# EasyEDA schematic SCH_Arduino-Train-v.2_2026-09-02.json
TITLE: Arduino Train; REV: 2.0.6; Date: 2026-09-01; Sheet: 1/1; Drawn By: @avatorl
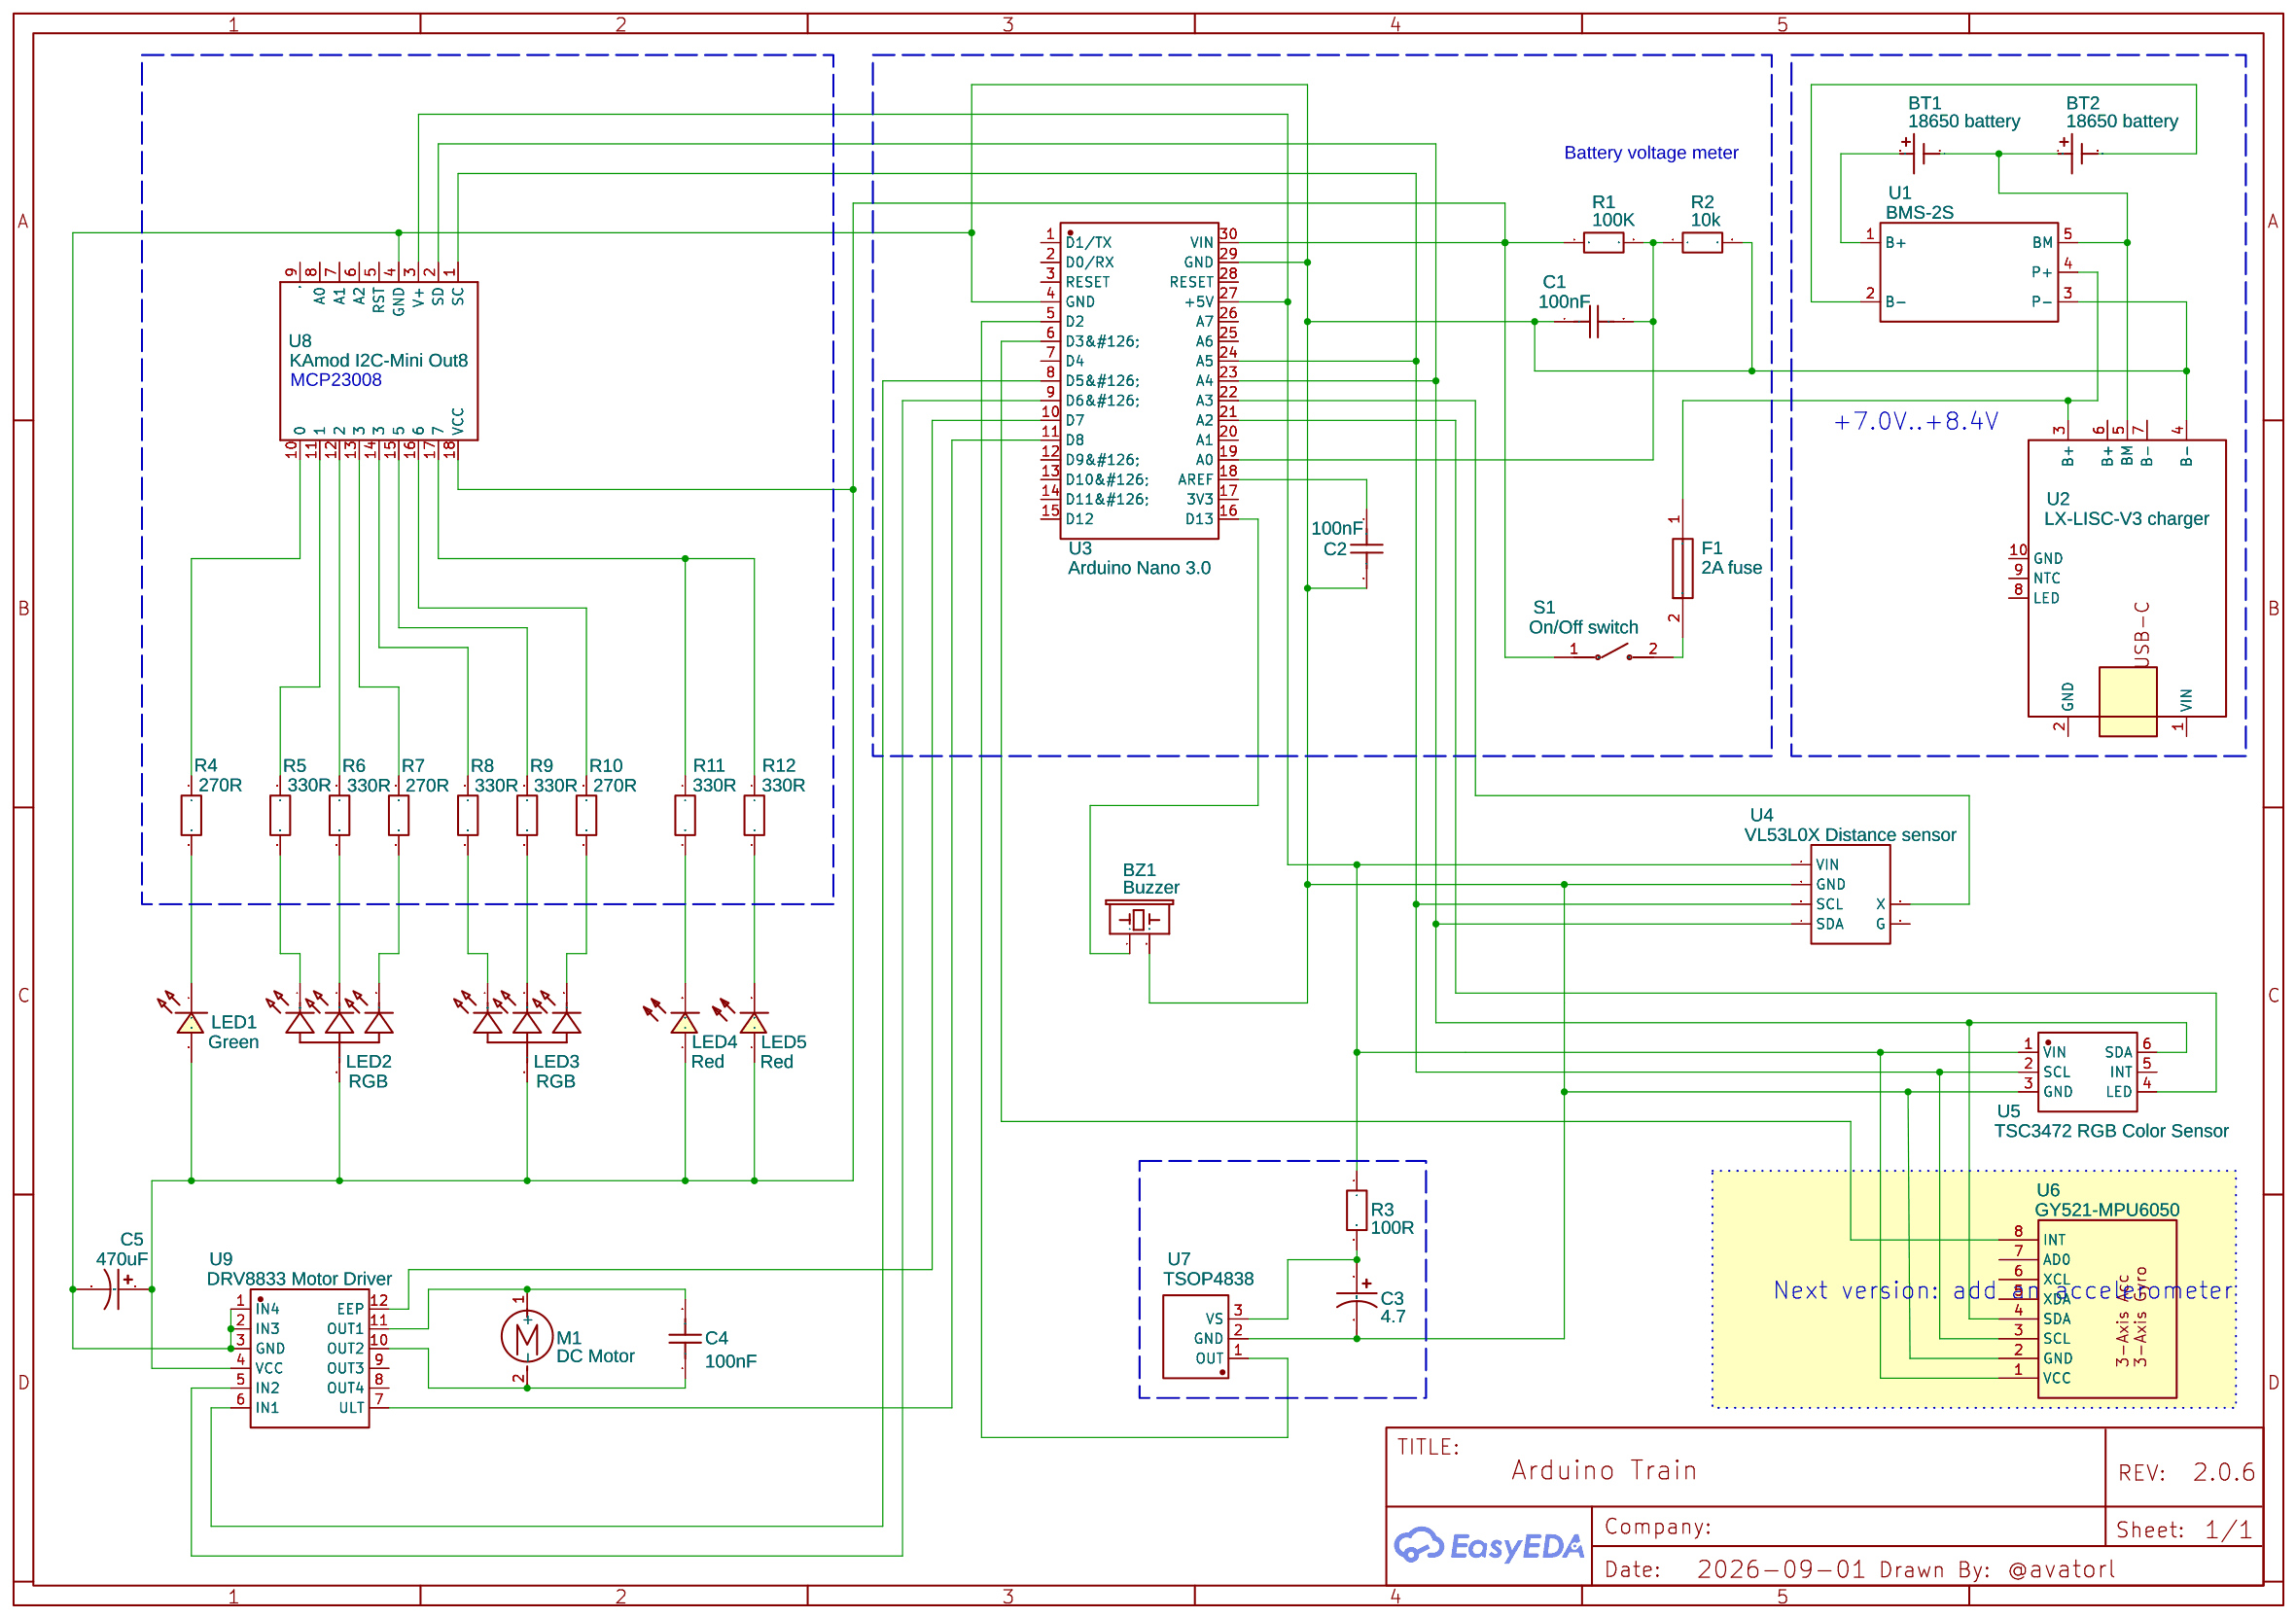
[diagram p0: schematic sheet]

## Parts
BT1  18650 battery  [HLD-18650]
BT2  18650 battery  [HLD-18650]
BZ1  Buzzer  [BUZZER-CMT1102]
C1  100nF  [CAPACITOR, 2.54MM PIN CAPACITOR]
C2  100nF  [CAPACITOR, 2.54MM PIN CAPACITOR]
C3  4.7  [ELECTROLITIC CAPACITOR 5MM]
C4  100nF  [CAPACITOR, 2.54MM PIN CAPACITOR]
C5  470uF  [ELECTROLITIC CAPACITOR 5MM]
F1  2A fuse  [FUSE_BLADE_PCB]
LED1  Green  [LED-TH_6P_LED4GREEN]
LED2  RGB  [LED-SMD_4P-L3.5-W2.8_3528RGB-6028RGB]
LED3  RGB  [LED-SMD_4P-L3.5-W2.8_3528RGB-6028RGB]
LED4  Red  [LED-TH_LED-3MM_RED]
LED5  Red  [LED-TH_LED-3MM_RED]
M1  DC Motor  [CONN-TH_2P-P5.08]
R1  100K  [R0603]
R2  10k  [R0603]
R3  100R  [R0603]
R4  270R  [R0603]
R5  330R  [R0603]
R6  330R  [R0603]
R7  270R  [R0603]
R8  330R  [R0603]
R9  330R  [R0603]
R10  270R  [R0603]
R11  330R  [R0603]
R12  330R  [R0603]
S1  On/Off switch  [SW-SMD_L3.9-W2.9-LS4.9-L]
U1  BMS-2S  [2S 3A-10A LITHIUM LI-ION 18650 BATTERY BMS PROTECTION PCB BOARD 7.4V/8.4V]
U2  LX-LISC-V3 charger  [LX-LISC-V1]
U3  Arduino Nano 3.0  [COMM-TH_ARDUINO_NANO]
U4  VL53L0X Distance sensor  [FFINAL_IDC-TH_8P-P2.54-V-R2-C4-S2.54]
U5  TSC3472 RGB Color Sensor  [SENSOR-SMD_TCS34725FN]
U6  GY521-MPU6050  [GY521-MPU6050]
U7  TSOP4838  [SENSOR-TH_TSOP4X]
U8  KAmod I2C-Mini Out8  [DIP18]
U9  DRV8833 Motor Driver  [DRV8833]

## Library data of the parts
BT1 BT2 = BAT-18650: Contributor: Rising Divergence
BZ1 = BUZZER: Contributor: SparkFun
C1 C2 C4 = C_0603_US: Contributor: antonioguadalupe265
C3 C5 = C_Tan_SMD_A_US: Supplier Part: C3810098; Supplier: LCSC; Contributor: ime10; Manufacturer Part: B32672P5105J000; Manufacturer: TDK
F1 = FUSE BLADE_PCB_MOUNT COPY: Contributor: Ahmad riski
LED1 = LED (GREEN): Supplier: LCSC; Supplier Part: C9900027004; Manufacturer: null; Manufacturer Part: LED三色(Red,Yellow,Green); link: https://atta.szlcsc.comnull; Contributor: boumninaotman7
LED2 LED3 = 3528RGB 6028RGB: Contributor: lcsc; Supplier: LCSC; Supplier Part: C9900020542; Manufacturer: null; Manufacturer Part: 3528反贴RGB 6028反贴RGB 缺口蓝色; JLCPCB Part Class: Extended Part
LED4 LED5 = LED: Supplier Part: C9900003389; Manufacturer Part: LED-3mm红; link: https://img.jlc.com/pdf/applyPasteComponent/2021-12-06/748033A/127ffe71aa84443fa05d6ffed81d0b6e/LED-3mm.pdf; Contributor: RD-5; JLCPCB Part Class: Extended Part
M1 = Motor_DC: Contributor: KiCAD; license: https://www.gnu.org/licenses/lgpl-2.1.html
R1-R12 = R_0603_EU: Contributor: LCEDA_Lib
S1 = BUTTON: Contributor: lcsc; Supplier: LCSC; Supplier Part: C9900015607; Manufacturer: null; JLCPCB Part Class: Extended Part
U1 = 2S 3A-10A Lithium Li-ion 18650 Battery BMS Protection PCB Board 7.4v/8.4V: Manufacturer Part: HX-2S-D01; Contributor: pavlo.turkot
U2 = LX-LISC-V1: Contributor: Citisenx
U3 = ARDUINO_NANO: Contributor: lcsc; Supplier: LCSC; Supplier Part: C9900017879; Manufacturer: null; JLCPCB Part Class: Extended Part; Package Display: No
U4 = GYUL53L0X_UPDATED final: Supplier: LCSC; Manufacturer: BOOMELE; Manufacturer Part: IDC Box 2X4 2.54MM; image: //image.lceda.cn/szlcsc/C9135.jpg; Supplier Part: C9135; Contributor: cnoofc
U5 = TCS34725FN: Contributor: LCSC; Supplier: LCSC; Supplier Part: C2649487; Manufacturer: ams(艾迈斯半导体); JLCPCB Part Class: Extended Part
U6 = GY521-MPU6050: Contributor: sinusya
U7 = TSOP4838: Contributor: LCSC; Supplier: LCSC; Manufacturer: VISHAY(威世); Supplier Part: C124647; JLCPCB Part Class: Extended Part
U8 = MCP23008P
U9 = DRV8833 - Motor Driver: Supplier: Add New Supplier; Contributor: Dalibor Drgon

## Nets
Net-(BT1-1): BT1.1(P) U1.1(B+)
Net-(BT1-2): BT1.2(N) BT2.1(P) U1.5(BM) U2.5(BM)
Net-(BT2-2): BT2.2(N) U1.2(B-)
Net-(BZ1-1): BZ1.1 U3.16(D13)
Net-(BZ1-2): BZ1.2 C1.1 C2.2 C3.2 C5.2 R2.2 U1.3(P-) U2.4(B-) U3.4(GND) U3.29(GND) U4.3(GND) U5.3(GND) U6.2(GND) U7.2(GND) U8.4(GND) U9.1(IN4) U9.2(IN3) U9.3(GND)
Net-(C1-2): C1.2 R1.2 R2.1 U3.19(A0)
Net-(C2-1): C2.1 U3.18(AREF)
Net-(C3-1): C3.1 R3.2 U7.3(VS)
Net-(C4-1): C4.1 M1.2(-) U9.10(OUT2)
Net-(C4-2): C4.2 M1.1(+) U9.11(OUT1)
Net-(C5-1): C5.1 LED1.2 LED2.3(A) LED3.3(A) LED4.1 LED5.1 R1.1 S1.1 U3.30(VIN) U8.18(VCC) U9.4(VCC)
Net-(F1-1): F1.1 U1.4(P+) U2.3(B+)
Net-(F1-2): F1.2 S1.2
Net-(LED1-1): LED1.1 R4.2
Net-(LED2-1): LED2.1(B) R6.2
Net-(LED2-2): LED2.2(R) R7.2
Net-(LED2-4): LED2.4(G) R5.2
Net-(LED3-1): LED3.1(B) R9.2
Net-(LED3-2): LED3.2(R) R10.2
Net-(LED3-4): LED3.4(G) R8.2
Net-(LED4-2): LED4.2 R11.2
Net-(LED5-2): LED5.2 R12.2
Net-(R3-1): R3.1 U3.27(+5V) U4.1(VIN) U5.1(VIN) U6.1(VCC) U8.3(V+)
Net-(R4-1): R4.1 U8.10(0)
Net-(R5-1): R5.1 U8.11(1)
Net-(R6-1): R6.1 U8.12(2)
Net-(R7-1): R7.1 U8.13(3)
Net-(R8-1): R8.1 U8.14(3)
Net-(R9-1): R9.1 U8.15(5)
Net-(R10-1): R10.1 U8.16(6)
Net-(R11-1): R11.1 R12.1 U8.17(7)
Net-(U3-5): U3.5(D2) U7.1(OUT)
Net-(U3-6): U3.6(D3&#126;) U6.8(INT)
Net-(U3-8): U3.8(D5&#126;) U9.6(IN1)
Net-(U3-9): U3.9(D6&#126;) U9.5(IN2)
Net-(U3-10): U3.10(D7) U9.12(EEP)
Net-(U3-11): U3.11(D8) U9.7(ULT)
Net-(U3-21): U3.21(A2) U5.4(LED)
Net-(U3-22): U3.22(A3) U4.6(X)
Net-(U3-23): U3.23(A4) U4.7(SDA) U5.6(SDA) U6.4(SDA) U8.2(SD)
Net-(U3-24): U3.24(A5) U4.5(SCL) U5.2(SCL) U6.3(SCL) U8.1(SC)

Not connected (* = marked no-connect by the designer): U2 1(VIN) 2(GND) 6(B+) 7(B-) 8(LED) 9(NTC) 10(GND); U3 1(D1/TX) 2(D0/RX) 3(RESET) 7(D4) 12(D9&#126;) 13(D10&#126;) 14(D11&#126;) 15(D12) 17(3V3) 20(A1) 25(A6) 26(A7) 28(RESET); U4 8(G); U5 5(INT); U6 5(XDA) 6(XCL) 7(AD0); U8 5(RST) 6(A2) 7(A1) 8(A0) 9(NC); U9 8(OUT4) 9(OUT3)

## Notes on the sheet
- Battery voltage meter
- MCP23008
- +7.0V..+8.4V
- Next version: add an accelerometer
